# EAGLE design Control (EAGLE 7.6.0)
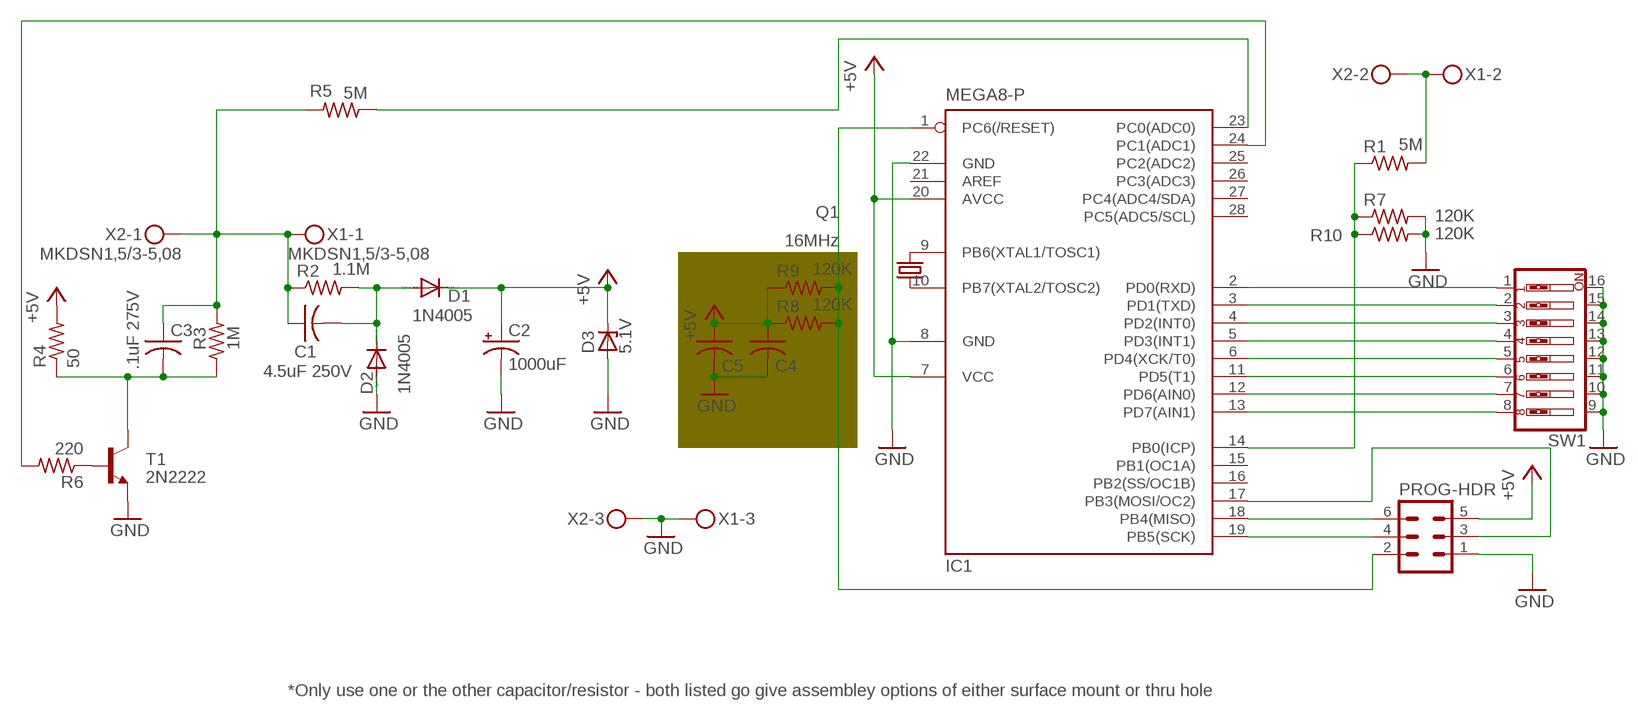
[diagram p0: schematic, sheet 1]

## Parts
C1  4.5uF 250V  C-US275-205X316  [C275-205X316]
C2  1000uF  CPOL-USE5-13  [E5-13]
C3  .1uF 275V  C-US150-091X182  [C150-091X182]
C4  C-US025-024X044  [C025-024X044]
C5  C-USC0402K  [C0402K]
D1  1N4005  1N4004  [DO41-10]
D2  1N4005  1N4004  [DO41-10]
D3  5.1V  ZENER-DIODEDO34-7  [DO34Z7]
IC1  MEGA8-P  [DIL28-3]
PROG-HDR  MA03-2  [MA03-2]
Q1  16MHz  CRYSTALTC38H  [TC38H]
R1  5M  R-US_0414/15  [0414/15]
R2  1.1M  R-US_0414/15  [0414/15]
R3  1M  R-US_0411/12  [0411/12]
R4  50  R-US_0309/12  [0309/12]
R5  5M  R-US_0411/12  [0411/12]
R6  220  R-US_0411/12  [0411/12]
R7  120K  R-US_0207/7  [0207/7]
R8  120K  R-US_0207/7  [0207/7]
R9  120K  R-US_M0805  [M0805]
R10  120K  R-US_M0805  [M0805]
SW1  SW_DIP-8  [EDG-08]
T1  2N2222  -NPN-TO92  [TO92]
X1  MKDSN1,5/3-5,08  [MKDSN1,5/3-5,08]
X2  MKDSN1,5/3-5,08  [MKDSN1,5/3-5,08]

## Nets
+5V: C2.+ C4.1 C5.1 D1.C D3.C IC1.7(VCC) IC1.20(AVCC) PROG-HDR.5 R4.2 R8.1 R9.1
GND: C2.- C4.2 C5.2 D2.A D3.A IC1.8(GND) IC1.22(GND) PROG-HDR.1 R7.2 R10.2 SW1.9 SW1.10 SW1.11 SW1.12 SW1.13 SW1.14 SW1.15 SW1.16 T1.1(E) X1.3 X2.3
N$1: R1.2 X1.2 X2.2
N$3: C1.1 C3.1 R2.1 R3.2 R5.2 X1.1 X2.1
N$4: C1.2 D1.A D2.C R2.2
N$5: R6.1 T1.2(B)
N$6: IC1.18(PB4(MISO)) PROG-HDR.6
N$7: IC1.19(PB5(SCK)) PROG-HDR.4
N$8: IC1.1(PC6(/RESET)) PROG-HDR.2 R8.2 R9.2
N$9: IC1.17(PB3(MOSI/OC2)) PROG-HDR.3
N$10: IC1.2(PD0(RXD)) SW1.1
N$11: IC1.3(PD1(TXD)) SW1.2
N$12: IC1.4(PD2(INT0)) SW1.3
N$13: IC1.5(PD3(INT1)) SW1.4
N$14: IC1.6(PD4(XCK/T0)) SW1.5
N$15: IC1.11(PD5(T1)) SW1.6
N$16: IC1.12(PD6(AIN0)) SW1.7
N$17: IC1.13(PD7(AIN1)) SW1.8
N$18: IC1.14(PB0(ICP)) R1.1 R7.1 R10.1
N$19: C3.2 R3.1 R4.1 T1.3(C)
N$20: IC1.9(PB6(XTAL1/TOSC1)) Q1.2
N$21: IC1.23(PC0(ADC0)) R5.1
N$22: IC1.24(PC1(ADC1)) R6.2
N$23: IC1.10(PB7(XTAL2/TOSC2)) Q1.1
Unconnected: IC1.15(PB1(OC1A)) IC1.16(PB2(SS/OC1B)) IC1.21(AREF) IC1.25(PC2(ADC2)) IC1.26(PC3(ADC3)) IC1.27(PC4(ADC4/SDA)) IC1.28(PC5(ADC5/SCL))

## Notes on the sheet
- *
- *Only use one or the other capacitor/resistor - both listed go give assembley options of either surface mount or thru hole

## Library data of the parts
C1 C3-C5 = rcl:C-US: CAPACITOR, American symbol
C2 = rcl:CPOL-US: POLARIZED CAPACITOR, American symbol
D1 D2 = diode:1N4004: DIODE general purpose rectifier, 1 A
D3 = diode:ZENER-DIODE: Z-Diode
IC1 = atmel:MEGA8-P: MICROCONTROLLER 8 Kbytes FLASH, 1 kbytes SRAM, 512 bytes EEPROM, USART, 4-channel 10 bit ADC, 2-channel 8 bit ADC Pin compatible with Atmega48, ATMega88, ATMega168 Source: avr.lbr; OC_FARNELL: unknown; OC_NEWARK: unknown
PROG-HDR = con-lstb:MA03-2: PIN HEADER; OC_FARNELL: unknown; OC_NEWARK: unknown
Q1 = crystal:CRYSTAL: CRYSTAL; OC_FARNELL: unknown; OC_NEWARK: unknown
R1-R10 = rcl:R-US_: RESISTOR, American symbol
SW1 = special:SW_DIP-8: DIP SWITCH
T1 = transistor-neu-to92:*-NPN-: NPN Transistror
X1 X2 = con-phoenix-508:MKDSN1,5/3-5,08: MKDSN 1,5/ 3-5,08 Printklemme Nennstrom: 13,5 A Nennspannung: 250 V Rastermaß: 5,08 mm Polzahl: 3 Anschlussart: Schraubanschluss Montage: Löten Anschlussrichtung Leiter/Platine: 0 ° Artikelnummer: 1729131 Source: http://eshop.phoenixcontact.com .. 1729131.pdf

## Board
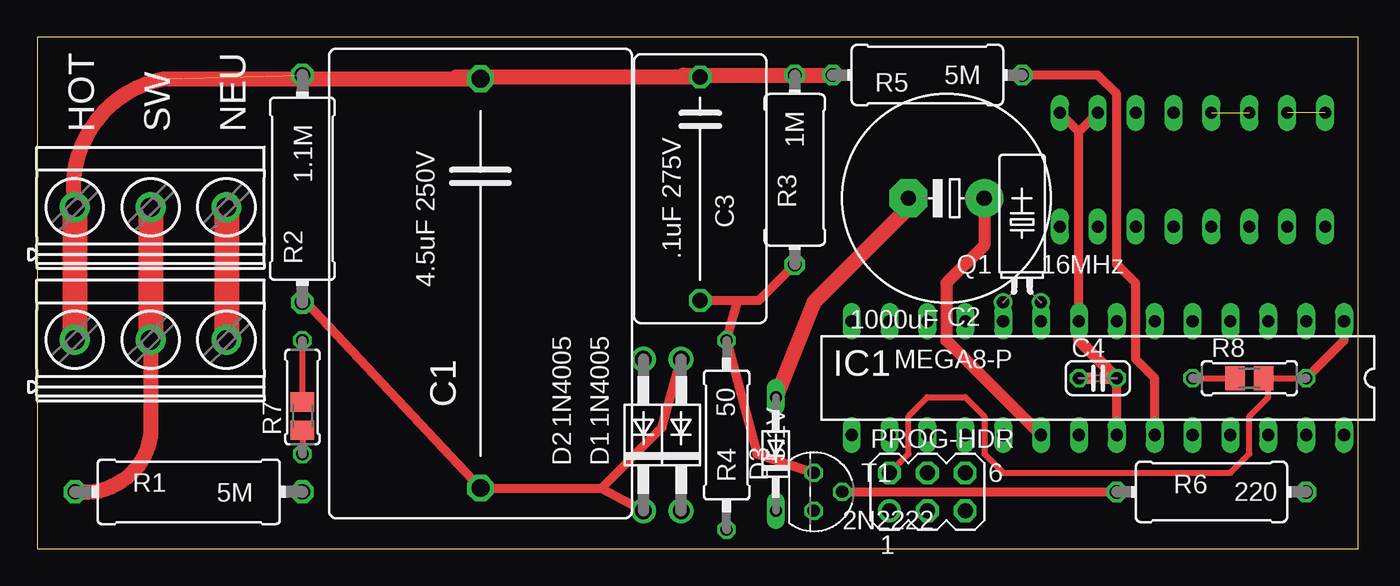
[diagram p1: board, top side]
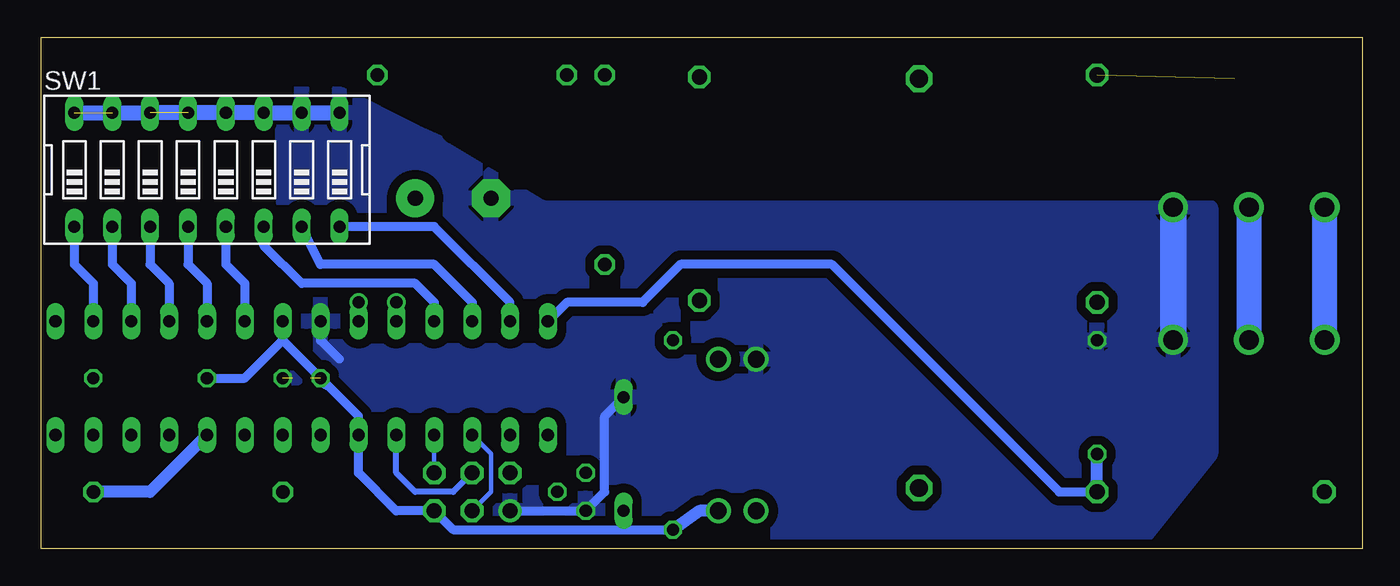
[diagram p2: board, bottom side, seen from below]

Size 88.57 x 34.28 mm. Coordinates in mm from the lower left corner, seen from the top.
Outline: 0,0 88.57,0 88.57,34.28 0,34.28 0,0
Copper layers (1*16): Top 0.035559375mm / dielectric 1.6mm / Bottom 0.035559375mm
Design rules "oshpark-2layer": minimum track width 6mil, minimum drill 10mil, track to track 6mil, track to pad 6mil, pad to pad 6mil, via to via 6mil, smd to smd 6mil, copper to edge 15mil, drill to drill 6mil, minimum pad ring 5mil, minimum via ring 5mil, stop-mask expansion 2.5mil, vias tented up to drill 0mil, thermal gap 10mil
bRestrict: area 8.9,24.1 to 61,33

### Footprints (pad centres in the part's own frame; a part is rotated, then mirrored left to right if it is on the bottom)
C275-205X316 = drill 1.194 octagon: 1 -13.716,0; 2 13.716,0
E5-13 = drill 1.016 pad 2.54: + -2.54,0 | drill 1.016 pad 2.54 octagon: - 2.54,0
C150-091X182 = drill 1.016 octagon: 1 -7.493,0; 2 7.493,0
C025-024X044 = drill 0.813 octagon: 1 -1.27,0; 2 1.27,0
C0402K = smd 0.925 x 0.74: 1 -0.6,0; 2 0.6,0
DO41-10 = drill 1.118: A 5.08,0; C -5.08,0
DO34Z7 = drill 0.813 long: A 3.81,0; C -3.81,0
DIL28-3 = drill 0.813 long: 1 -16.51,-3.81; 2 -13.97,-3.81; 3 -11.43,-3.81; 4 -8.89,-3.81; 5 -6.35,-3.81; 6 -3.81,-3.81; 7 -1.27,-3.81; 8 1.27,-3.81; 9 3.81,-3.81; 10 6.35,-3.81; 11 8.89,-3.81; 12 11.43,-3.81; 13 13.97,-3.81; 14 16.51,-3.81; 15 16.51,3.81; 16 13.97,3.81; 17 11.43,3.81; 18 8.89,3.81; 19 6.35,3.81; 20 3.81,3.81; 21 1.27,3.81; 22 -1.27,3.81; 23 -3.81,3.81; 24 -6.35,3.81; 25 -8.89,3.81; 26 -11.43,3.81; 27 -13.97,3.81; 28 -16.51,3.81
MA03-2 = drill 1.016: 1 -2.54,-1.27 | drill 1.016 octagon: 2 -2.54,1.27; 3 0,-1.27; 4 0,1.27; 5 2.54,-1.27; 6 2.54,1.27
TC38H = drill 0.813: 1 -1.27,0; 2 1.27,0
0414/15 = drill 1.016 octagon: 1 -7.62,0; 2 7.62,0
0411/12 = drill 0.914 octagon: 1 -6.35,0; 2 6.35,0
0309/12 = drill 0.813 octagon: 1 -6.35,0; 2 6.35,0
0207/7 = drill 0.813 octagon: 1 -3.81,0; 2 3.81,0
M0805 = smd 1.3 x 1.6: 1 -0.95,0; 2 0.95,0
EDG-08 = drill 0.813 long: 1 -8.89,-3.81; 2 -6.35,-3.81; 3 -3.81,-3.81; 4 -1.27,-3.81; 5 1.27,-3.81; 6 3.81,-3.81; 7 6.35,-3.81; 8 8.89,-3.81; 9 8.89,3.81; 10 6.35,3.81; 11 3.81,3.81; 12 1.27,3.81; 13 -1.27,3.81; 14 -3.81,3.81; 15 -6.35,3.81; 16 -8.89,3.81
TO92 = drill 0.813 octagon: 1 1.27,0; 2 0,1.905; 3 -1.27,0
MKDSN1,5/3-5,08 = drill 1.3 pad 2: 1 -7.641,0.025; 2 -2.561,0.025; 3 2.519,0.025

### Placement (x,y rotation side)
C1  29.72,17.78 270 top
C2  60.96,23.5 180 top
C3  44.45,24.13 270 top
C4  71.12,11.43 0 top
C5  71.12,11.43 0 top
D1  43.18,7.62 90 top
D2  40.64,7.62 90 top
D3  49.53,6.35 90 top
IC1  71.12,11.43 180 top
PROG-HDR  59.69,3.81 0 top
Q1  66.04,16.51 0 top
R1  10.16,3.81 180 top
R2  17.78,24.13 270 top
R3  50.8,25.4 90 top
R4  46.23,7.62 270 top
R5  59.69,31.75 180 top
R6  78.74,3.81 0 top
R7  17.78,10.16 90 top
R8  81.28,11.43 0 top
R9  81.28,11.43 0 top
R10  17.78,8.89 90 top
SW1  77.47,25.4 0 bottom
T1  52.07,3.81 270 top
X1  10.16,13.97 0 top
X2  10.16,22.86 0 top

### Tracks (layer width: path | path; a pad name or v marks a point on that pad's centre or on a via)
+5V  (1 unrouted)
  Top 0.406: R8.1 R9.1
  Top 0.813: C2.+ 63.5,20.32 60.96,17.78 60.96,13.97 IC1.20
  Bottom 0.406: C4.1 arc-90 69.22,10.79
  Bottom 0.61: 72.39,13.97 C4.1 69.22,10.79 67.31,8.89 IC1.20 67.31,5.08 64.77,2.54 PROG-HDR.5 60.96,1.27 49.53,1.27 | 72.39,13.97 IC1.7 | R8.1 74.93,11.43 72.39,13.97 | 49.53,1.27 R4.2 | D3.C 49.53,1.27
  Bottom 0.813: D1.C 44.45,2.54 R4.2
GND  (3 unrouted)
  Top 0.406: R10.2 R7.2
  Top 0.61: IC1.22 C4.2 | IC1.8 69.85,27.94 | 69.85,27.94 SW1.9 | 69.85,27.94 SW1.10
  Top 0.813: IC1.8 69.85,13.97 C4.2
  Top 1.016: 58.42,22.86 52.07,16.51 D3.A
  Bottom 0.61: IC1.8 69.85,13.97 68.58,12.7 | PROG-HDR.1 T1.1 50.8,3.81 50.8,8.89 D3.A
  Bottom 1.016: SW1.16 SW1.14 SW1.12 SW1.11 SW1.9
  Bottom 1.778: X2.3 X1.3
  pour Bottom (isolate 0.61): 10.16,22.86 10.16,6.35 15.24,0 66.04,1.27 71.12,8.89 72.39,24.13 72.39,30.48 68.58,30.48 63.5,27.94 52.07,22.86
N$1
  Top 1.016: X1.2 7.6,7.6 arc-90 R1.2
  Top 1.676: X2.2 X1.2
N$2
  Bottom 1.676: 2.54,22.86 2.54,13.97
N$3  (1 unrouted)
  Top 1.016: R5.2 R3.2 43.31,31.75 C3.1 28.07,31.62 C1.1 8.59,31.5 arc90 X2.1
  Top 1.676: X2.1 X1.1
N$4
  Top 0.61: 37.85,4.06 C1.2 18.03,16.51 R2.2 | 37.85,4.06 D2.C | 37.85,4.06 41.91,8.13 D1.A
N$5
  Top 0.61: T1.2 R6.1
N$6
  Bottom 0.305: PROG-HDR.6 IC1.18
N$7
  Bottom 0.406: PROG-HDR.4 60.96,3.81 63.5,3.81 64.77,5.08 IC1.19
N$8
  Top 0.406: R8.2 R9.2 82.55,11.11 82.55,10.16 81.28,8.89 81.28,6.35 80.01,5.08 64.77,5.08 63.5,6.35 63.5,8.89 62.23,10.16 59.69,10.16 58.42,8.89 58.42,6.35 PROG-HDR.2
  Top 0.61: R8.2 87.63,13.97 IC1.1
N$9
  Bottom 0.305: PROG-HDR.3 58.42,3.81 58.42,6.35 IC1.17
N$10
  Bottom 0.61: SW1.1 86.36,19.05 85.09,17.78 IC1.2
N$11
  Bottom 0.61: SW1.2 83.82,19.05 82.55,17.78 IC1.3
N$12
  Bottom 0.61: SW1.3 81.28,19.05 80.01,17.78 IC1.4
N$13
  Bottom 0.61: SW1.4 78.74,19.05 77.47,17.78 IC1.5
N$14
  Bottom 0.61: SW1.5 76.2,19.05 74.93,17.78 IC1.6
N$15
  Bottom 0.61: IC1.11 62.23,16.51 63.5,17.78 71.12,17.78 73.66,20.32 SW1.6
N$16
  Bottom 0.61: IC1.12 59.69,16.51 62.23,19.05 69.85,19.05 SW1.7
N$17
  Bottom 0.61: IC1.13 57.15,16.51 62.23,21.59 SW1.8
N$18
  Top 0.406: R10.1 R7.1
  Bottom 0.61: IC1.14 53.34,16.51 48.26,16.51 45.72,19.05 35.56,19.05 20.32,3.81 R1.1
  Bottom 0.813: R1.1 R7.1
N$19
  Top 0.61: C3.2 46.99,16.64 | 46.99,16.64 48.39,16.64 R3.1 | 46.99,16.64 R4.1 48.26,6.35 T1.3
N$20
  Bottom 0.406: Q1.2 IC1.9
N$21
  Top 0.61: IC1.23 74.93,11.43 73.66,12.7 73.66,17.78 72.39,19.05 72.39,30.48 71.12,31.75 R5.1
N$22
  Bottom 0.813: IC1.24 81.28,3.81 R6.2
N$23
  Bottom 0.406: Q1.1 IC1.10
N$24
  Bottom 1.676: 7.62,22.86 7.62,13.97
N$25
  Top 1.676: 12.7,22.86 12.7,13.97

### Text on the board
tNames: HOT | SW | NEU